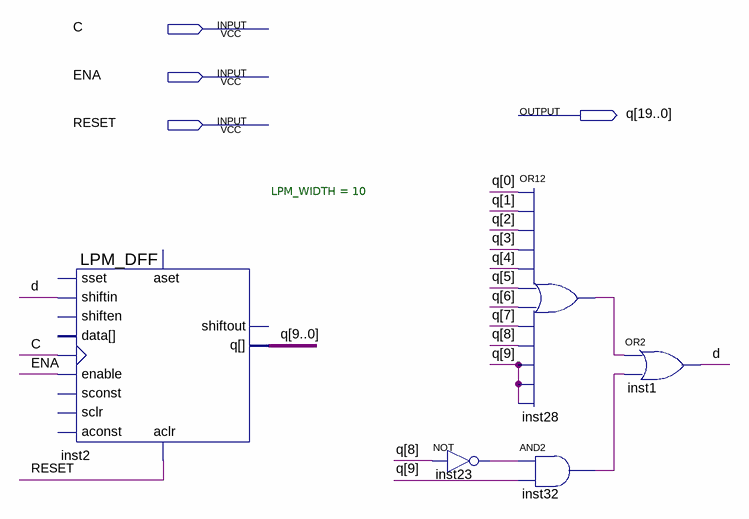
[diagram p0: schematic sheet]
// Quartus schematic shift_rg.bdf as structural Verilog: 5 symbols, 4 pins
module shift_rg (
  input  C,
  input  ENA,
  input  RESET,
  output [19:0] q
);

  wire d, inst23_out, inst28_out, inst32_out;

  LPM_DFF #(.LPM_WIDTH(10)) inst2 (
    .shiftin(d), .enable(ENA), .clock(C), .aclr(RESET), .q(q[9:0]));  // open: shiften, data, aconst, sclr, sconst, sset, aset, shiftout
  not inst23 (inst23_out, q[8]);
  or inst28 (inst28_out, q[0], q[1], q[2], q[3], q[4], q[5], q[6], q[7], q[8], q[9], q[9], q[9]);
  and inst32 (inst32_out, inst23_out, q[9]);
  or inst1 (d, inst28_out, inst32_out);
endmodule
